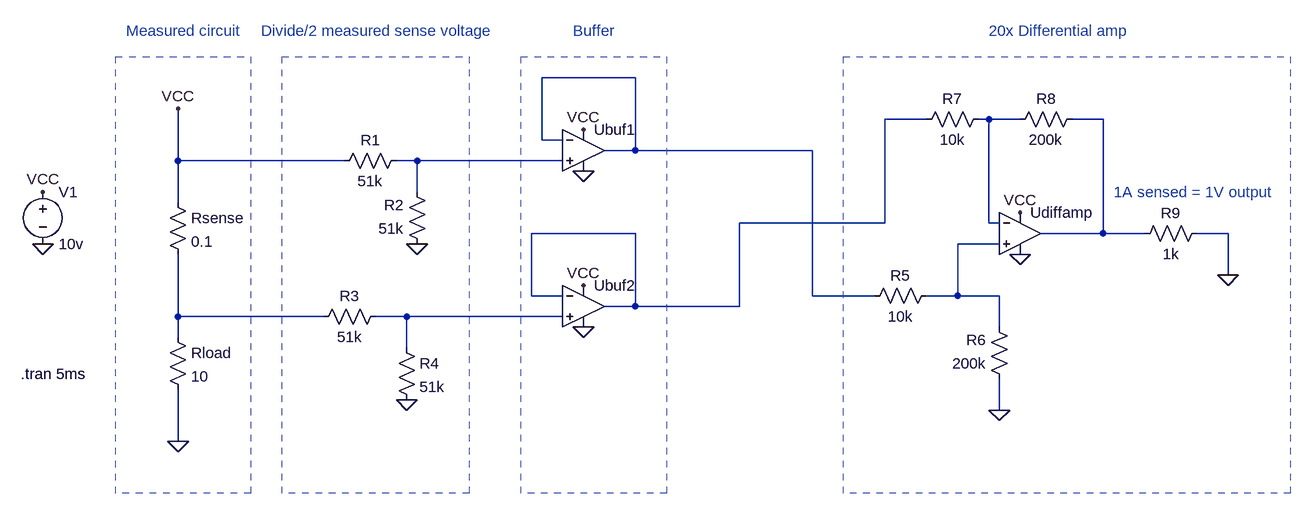
[diagram p0: schematic differential-current-sensor.asc]
differential-current-sensor.asc, the LTspice schematic file:
Version 4
SHEET 1 2356 680
WIRE 1344 -224 1200 -224
WIRE 1792 -160 1728 -160
WIRE 1888 -160 1872 -160
WIRE 1936 -160 1888 -160
WIRE 2064 -160 2016 -160
WIRE 1200 -128 1200 -224
WIRE 1232 -128 1200 -128
WIRE 1344 -112 1344 -224
WIRE 1344 -112 1296 -112
WIRE 1616 -112 1344 -112
WIRE 640 -96 640 -176
WIRE 896 -96 640 -96
WIRE 1008 -96 976 -96
WIRE 1232 -96 1008 -96
WIRE 1008 -48 1008 -96
WIRE 640 -32 640 -96
WIRE 1728 0 1728 -160
WIRE 1728 0 1504 0
WIRE 1888 0 1888 -160
WIRE 1904 0 1888 0
WIRE 1344 16 1184 16
WIRE 2064 16 2064 -160
WIRE 2064 16 1968 16
WIRE 2128 16 2064 16
WIRE 2256 16 2208 16
WIRE 1904 32 1840 32
WIRE 2256 80 2256 16
WIRE 1184 112 1184 16
WIRE 1232 112 1184 112
WIRE 1616 112 1616 -112
WIRE 1712 112 1616 112
WIRE 1840 112 1840 32
WIRE 1840 112 1792 112
WIRE 1904 112 1840 112
WIRE 1344 128 1344 16
WIRE 1344 128 1296 128
WIRE 1504 128 1504 0
WIRE 1504 128 1344 128
WIRE 640 144 640 48
WIRE 864 144 640 144
WIRE 992 144 944 144
WIRE 1232 144 992 144
WIRE 1904 160 1904 112
WIRE 640 176 640 144
WIRE 992 192 992 144
WIRE 1904 288 1904 240
WIRE 640 336 640 256
FLAG 432 32 0
FLAG 432 -48 VCC
FLAG 640 336 0
FLAG 640 -176 VCC
FLAG 1264 -144 VCC
FLAG 1264 96 VCC
FLAG 1264 160 0
FLAG 1264 -80 0
FLAG 992 272 0
FLAG 1008 32 0
FLAG 1936 -16 VCC
FLAG 1936 48 0
FLAG 2256 80 0
FLAG 1904 288 0
SYMBOL voltage 432 -64 R0
WINDOW 123 0 0 Left 0
WINDOW 39 0 0 Left 0
SYMATTR InstName V1
SYMATTR Value 10v
SYMBOL res 624 -48 R0
SYMATTR InstName Rsense
SYMATTR Value 0.1
SYMBOL res 624 160 R0
SYMATTR InstName Rload
SYMATTR Value 10
SYMBOL OpAmps\\UniversalOpamp2 1264 -112 R0
SYMATTR InstName Ubuf1
SYMBOL OpAmps\\UniversalOpamp2 1264 128 R0
SYMATTR InstName Ubuf2
SYMBOL res 992 -112 R90
WINDOW 0 0 56 VBottom 2
WINDOW 3 32 56 VTop 2
SYMATTR InstName R1
SYMATTR Value 51k
SYMBOL res 1024 48 R180
WINDOW 0 36 76 Left 2
WINDOW 3 36 40 Left 2
SYMATTR InstName R2
SYMATTR Value 51k
SYMBOL res 848 160 R270
WINDOW 0 32 56 VTop 2
WINDOW 3 0 56 VBottom 2
SYMATTR InstName R3
SYMATTR Value 51k
SYMBOL res 976 176 R0
SYMATTR InstName R4
SYMATTR Value 51k
SYMBOL OpAmps\\UniversalOpamp2 1936 16 R0
SYMATTR InstName Udiffamp
SYMBOL res 1808 96 R90
WINDOW 0 0 56 VBottom 2
WINDOW 3 32 56 VTop 2
SYMATTR InstName R5
SYMATTR Value 10k
SYMBOL res 1920 256 R180
WINDOW 0 36 76 Left 2
WINDOW 3 36 40 Left 2
SYMATTR InstName R6
SYMATTR Value 200k
SYMBOL res 1776 -144 R270
WINDOW 0 32 56 VTop 2
WINDOW 3 0 56 VBottom 2
SYMATTR InstName R7
SYMATTR Value 10k
SYMBOL res 2224 0 R90
WINDOW 0 0 56 VBottom 2
WINDOW 3 32 56 VTop 2
SYMATTR InstName R9
SYMATTR Value 1k
SYMBOL res 2032 -176 R90
WINDOW 0 0 56 VBottom 2
WINDOW 3 32 56 VTop 2
SYMATTR InstName R8
SYMATTR Value 200k
TEXT 398 232 Left 2 !.tran 5ms
TEXT 560 -296 Left 2 ;Measured circuit
TEXT 768 -296 Left 2 ;Divide/2 measured sense voltage
TEXT 1248 -296 Left 2 ;Buffer
TEXT 1888 -296 Left 2 ;20x Differential amp
TEXT 2080 -48 Left 2 ;1A sensed = 1V output
RECTANGLE Normal 752 416 544 -256 2
RECTANGLE Normal 1088 416 800 -256 2
RECTANGLE Normal 1392 416 1168 -256 2
RECTANGLE Normal 2352 416 1664 -256 2

The netlist it stands for:
* differential-current-sensor.asc
V1 VCC 0 10v
Rsense VCC N007 0.1
Rload N007 0 10
XUbuf1 N005 N001 VCC 0 N001 level.2 Avol=1Meg GBW=10Meg Slew=10Meg ilimit=25m rail=0 Vos=0 phimargin=45 en=0 enk=0 in=0 ink=0 Rin=500Meg  ; pins IN+ IN- V+ V- OUT
XUbuf2 N008 N002 VCC 0 N002 level.2 Avol=1Meg GBW=10Meg Slew=10Meg ilimit=25m rail=0 Vos=0 phimargin=45 en=0 enk=0 in=0 ink=0 Rin=500Meg  ; pins IN+ IN- V+ V- OUT
R1 N005 VCC 51k
R2 0 N005 51k
R3 N007 N008 51k
R4 N008 0 51k
XUdiffamp N006 N003 VCC 0 N004 level.2 Avol=1Meg GBW=10Meg Slew=10Meg ilimit=25m rail=0 Vos=0 phimargin=45 en=0 enk=0 in=0 ink=0 Rin=500Meg  ; pins IN+ IN- V+ V- OUT
R5 N006 N001 10k
R6 0 N006 200k
R7 N002 N003 10k
R9 0 N004 1k
R8 N004 N003 200k
.tran 5ms
* Measured circuit
* Divide/2 measured sense voltage
* Buffer
* 20x Differential amp
* 1A sensed = 1V output
.lib UniversalOpamps2.sub
.backanno
.end